# Altium schematic sheet Microcontroller.SchDoc: <?>
size 420 x 297 mm; ApprovedBy: <?>; CheckedBy: <?>; CompanyName: ISON IMPORT-EXPORT COMPANY LIMITED; DrawnBy: <?>; DocumentNumber: <?>; Revision: <?>; SheetNumber: <?>; SheetTotal: <?>; Size: A3; ISON_Model: <?>
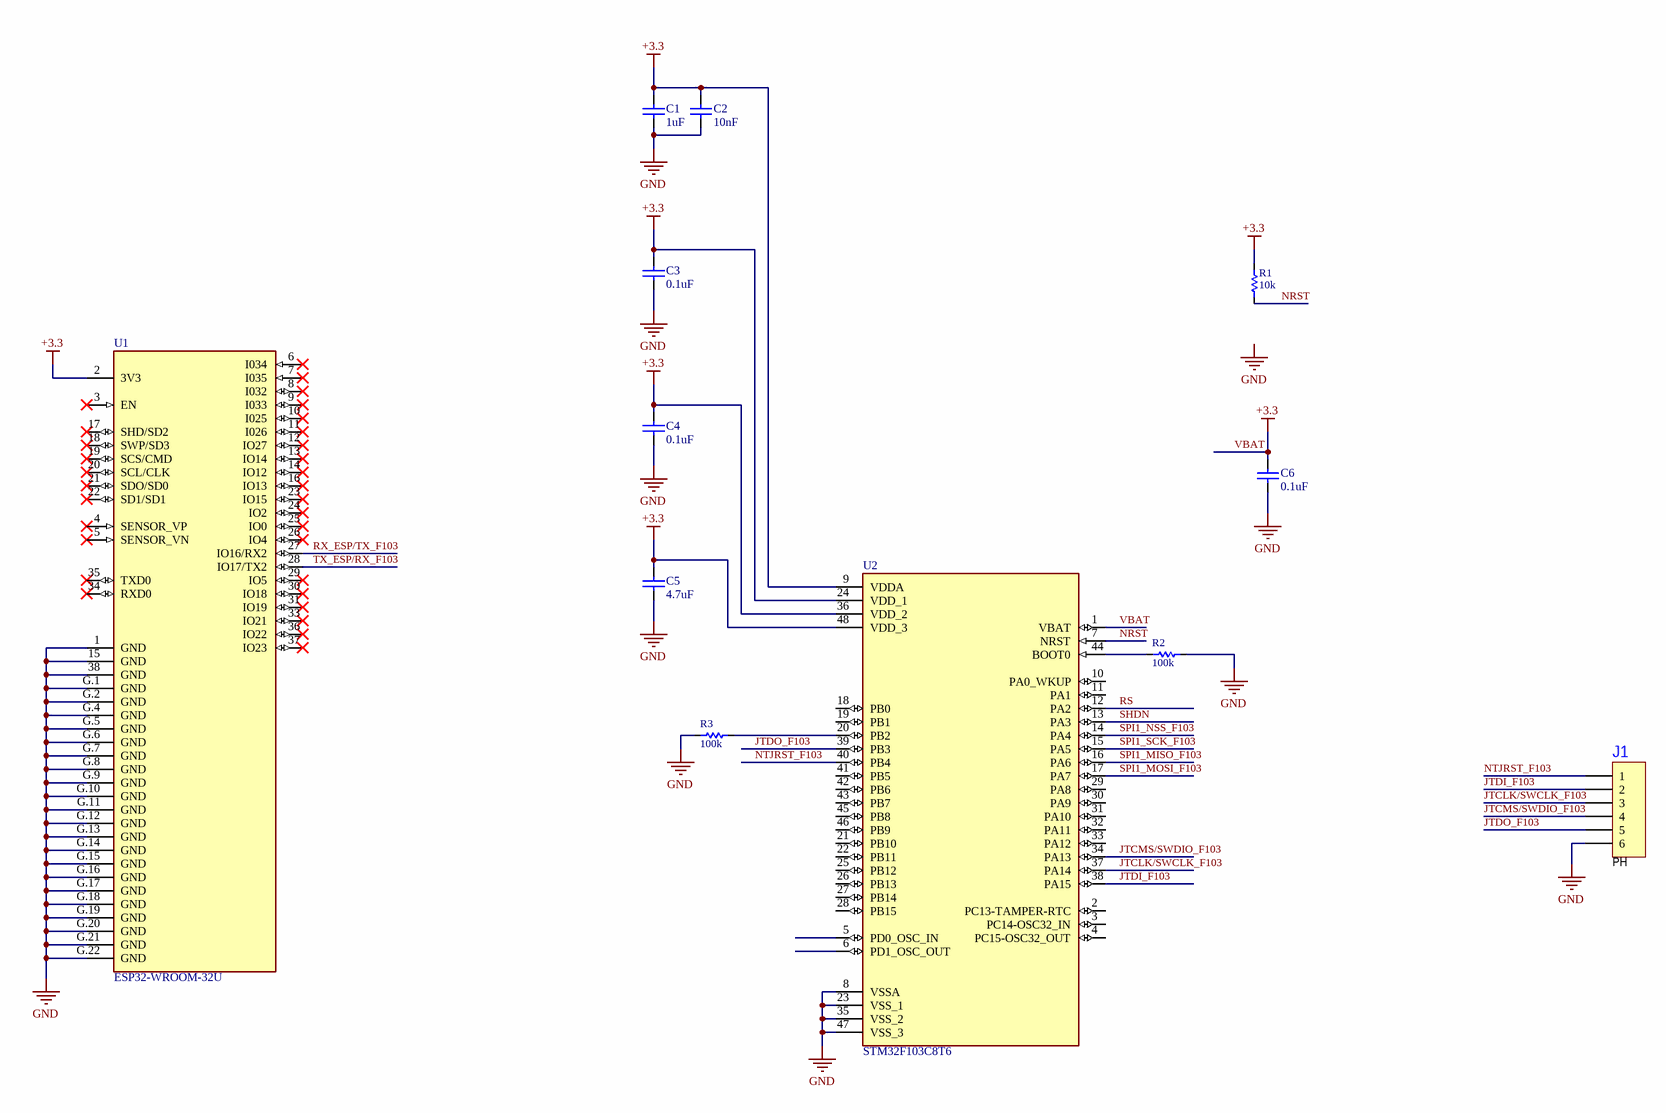
[diagram p0: Microcontroller.SchDoc]

## Parts
C1  1uF  [CAPC2012X135N]
C2  10nF  [CAPC2012X135N]
C3  0.1uF  [CAPC2012X135N]
C4  0.1uF  [CAPC2012X135N]
C5  4.7uF  [CAPC2012X135N]
C6  0.1uF  [CAPC2012X135N]
J1  PH  [HDR1X6]
R1  10k  [0805 MODIFICADO]
R2  100k  [0805 MODIFICADO]
R3  100k  [0805 MODIFICADO]
U1  ESP32-WROOM-32U  [XCVR_ESP32-WROOM-32U]
U2  STM32F103C8T6  [QFP50P900X900X160-48N]

## Nets
GND: C1.1 C2.1 C3.1 C4.1 C5.1 C6.1 J1.6 R2.2 R3.1 U1.1(GND) U1.15(GND) U1.38(GND) U1.G.1(GND) U1.G.2(GND) U1.G.4(GND) U1.G.5(GND) U1.G.6(GND) U1.G.7(GND) U1.G.8(GND) U1.G.9(GND) U1.G.10(GND) U1.G.11(GND) U1.G.12(GND) U1.G.13(GND) U1.G.14(GND) U1.G.15(GND) U1.G.16(GND) U1.G.17(GND) U1.G.18(GND) U1.G.19(GND) U1.G.20(GND) U1.G.21(GND) U1.G.22(GND) U2.8(VSSA) U2.23(VSS_1) U2.35(VSS_2) U2.47(VSS_3)
VBAT: C1.2 C2.2 C3.2 C4.2 C5.2 C6.2 R1.2 U1.2(3V3) U2.1(VBAT) U2.9(VDDA) U2.24(VDD_1) U2.36(VDD_2) U2.48(VDD_3)  [also labelled +3.3]
JTCLK/SWCLK_F103: J1.3 U2.37(PA14)
JTCMS/SWDIO_F103: J1.4 U2.34(PA13)
JTDI_F103: J1.2 U2.38(PA15)
JTDO_F103: J1.5 U2.39(PB3)
NRST: R1.1 U2.7(NRST)
NTJRST_F103: J1.1 U2.40(PB4)
RS: U2.12(PA2)
RX_ESP/TX_F103: U1.27(IO16/RX2)
SHDN: U2.13(PA3)
SPI1_MISO_F103: U2.16(PA6)
SPI1_MOSI_F103: U2.17(PA7)
SPI1_NSS_F103: U2.14(PA4)
SPI1_SCK_F103: U2.15(PA5)
TX_ESP/RX_F103: U1.28(IO17/TX2)
NetR2_1: R2.1 U2.44(BOOT0)
NetR3_2: R3.2 U2.20(PB2)

Not connected (* = marked no-connect by the designer): U1 3(EN)* 4(SENSOR_VP)* 5(SENSOR_VN)* 6(I034)* 7(I035)* 8(I032)* 9(I033)* 10(I025)* 11(I026)* 12(IO27)* 13(IO14)* 14(IO12)* 16(IO13)* 17(SHD/SD2)* 18(SWP/SD3)* 19(SCS/CMD)* 20(SCL/CLK)* 21(SDO/SD0)* 22(SD1/SD1)* 23(IO15)* 24(IO2)* 25(IO0)* 26(IO4)* 29(IO5)* 30(IO18)* 31(IO19)* 33(IO21)* 34(RXD0)* 35(TXD0)* 36(IO22)* 37(IO23)*; U2 2(PC13-TAMPER-RTC) 3(PC14-OSC32_IN) 4(PC15-OSC32_OUT) 5(PD0_OSC_IN) 6(PD1_OSC_OUT) 10(PA0_WKUP) 11(PA1) 18(PB0) 19(PB1) 21(PB10) 22(PB11) 25(PB12) 26(PB13) 27(PB14) 28(PB15) 29(PA8) 30(PA9) 31(PA10) 32(PA11) 33(PA12) 41(PB5) 42(PB6) 43(PB7) 45(PB8) 46(PB9)

## Notes on the sheet
- Labels drawn without touching a wire or pin: GND
- Modify 1:
- DWG No:
- Model:
- SHEET:
- Modify 2:
- ORIGINAL:
- Revision:
- Date:
- Draw By:
- Size:
- File:
- Approve By:
- TOTAL:
- Modify 3:

## Library data of the parts
C1-C6 = CAP_0.1_50V_0805: Capacitor SMD Ceramic Chip Cap 0.1uF 50V (0805) (AVX); RMPN: RMELCCAPSC001; Value: 0.1uF, 50V Ceramic; Created by: Zion Blue; Published: 28 April 2014; Publisher: Cynetik Group; RM DESC: Capacitor SMD Ceramic Chip Cap 0.1uF 50V (0805) (AVX); MPN: *; Manufacturer: *
J1 = Connector 6x1 Pin Header: Connector 6 x 1 PIN Header 2.54 x 2.54 mm; LatestRevisionDate: 17-Jul-2002; LatestRevisionNote: Re-released for DXP Platform.; Publisher: Altium Limited
R1-R3 = RES_100K_1/8W_0805: 0805 100K OHM Resistor .
U1 = ESP32-WROOM-32U: Bluetooth, WiFi 802.11b/g/n, Bluetooth v4.2 +EDR, Class 1, 2 and 3 Transceiver Module 2.4GHz ~ 2.5GHz Antenna Not Included, U.FL Surface Mount; MF: Espressif Systems; MP: ESP32-WROOM-32U; Price: None; Package: NON STANDARD-39 Espressif; Check_prices: https://www.snapeda.com/parts/ESP32-WROOM-32U/Espressif+Systems/view-part/?ref=eda; Value: *; Availability: Not in stock; SnapEDA_Link: https://www.snapeda.com/parts/ESP32-WROOM-32U/Espressif+Systems/view-part/?ref=snap
U2 = STM32F103C8T6: ARM® Cortex®-M3 STM32F1 Microcontroller IC 32-Bit 72MHz 64KB (64K x 8) FLASH 48-LQFP (7x7); MF: STMicroelectronics; Package: LQFP-48 STMicroelectronics; Price: None; Check_prices: https://www.snapeda.com/parts/STM32F103C8T6/STMicroelectronics/view-part/?ref=eda; Value: *; SnapEDA_Link: https://www.snapeda.com/parts/STM32F103C8T6/STMicroelectronics/view-part/?ref=snap; MP: STM32F103C8T6; Availability: In Stock; Purchase-URL: https://pricing.snapeda.com/search/part/STM32F103C8T6/?ref=eda